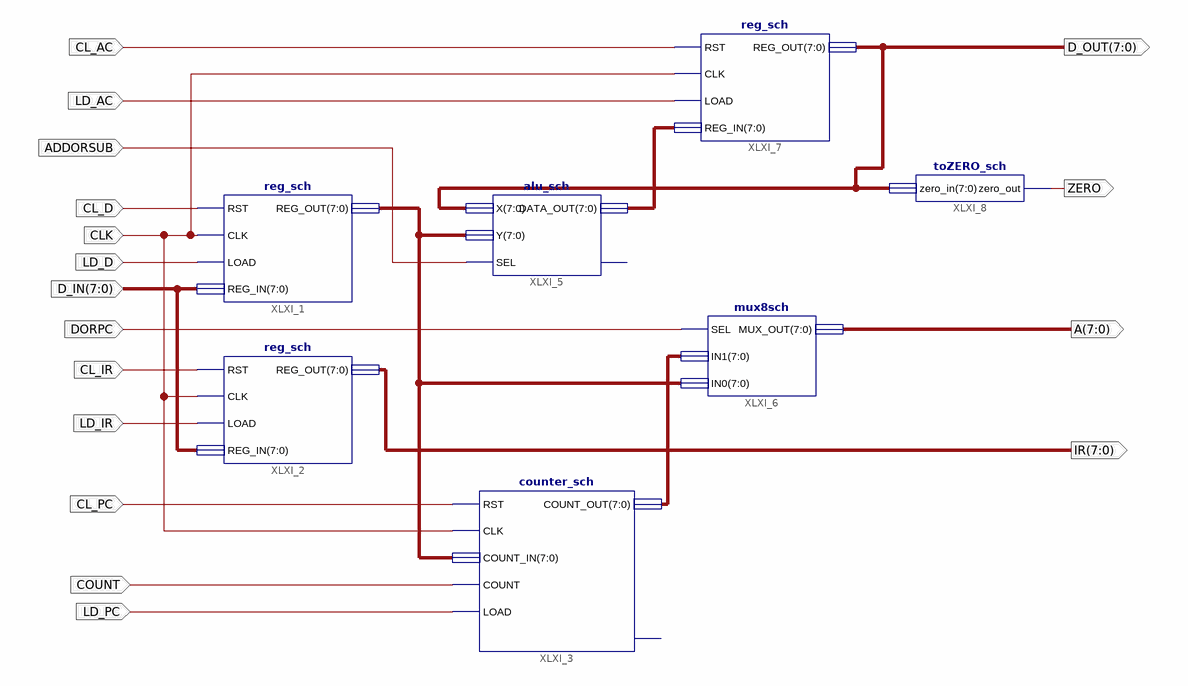
[diagram p0: schematic sheet 1]
// Xilinx ISE schematic Datapath_sch.sch (spartan3e) as structural Verilog: 7 symbols, 17 ports
module Datapath_sch (
  input  CL_D,
  input  LD_D,
  input  CL_IR,
  input  CLK,
  input  [7:0] D_IN,
  input  LD_IR,
  input  CL_PC,
  input  COUNT,
  input  LD_PC,
  input  ADDORSUB,
  input  DORPC,
  input  CL_AC,
  input  LD_AC,
  output [7:0] A,
  output [7:0] IR,
  output ZERO,
  output [7:0] D_OUT
);

  wire [7:0] XLXN_19, XLXN_27, XLXN_30;

  reg_sch XLXI_1 (.RST(CL_D), .CLK(CLK), .LOAD(LD_D), .REG_IN(D_IN), .REG_OUT(XLXN_30));
  reg_sch XLXI_2 (.RST(CL_IR), .CLK(CLK), .LOAD(LD_IR), .REG_IN(D_IN), .REG_OUT(IR));
  counter_sch XLXI_3 (
    .RST(CL_PC), .CLK(CLK), .COUNT_IN(XLXN_30), .COUNT(COUNT), .LOAD(LD_PC), .COUNT_OUT(XLXN_19));  // open: OVERFLOW
  alu_sch XLXI_5 (.X(D_OUT), .Y(XLXN_30), .SEL(ADDORSUB), .DATA_OUT(XLXN_27));  // open: Cnext
  mux8sch XLXI_6 (.SEL(DORPC), .IN1(XLXN_19), .IN0(XLXN_30), .MUX_OUT(A));
  reg_sch XLXI_7 (.RST(CL_AC), .CLK(CLK), .LOAD(LD_AC), .REG_IN(XLXN_27), .REG_OUT(D_OUT));
  toZERO_sch XLXI_8 (.zero_in(D_OUT), .zero_out(ZERO));
endmodule
